# Altium schematic sheet 主控原理图（AD打开）.SchDoc
size A3
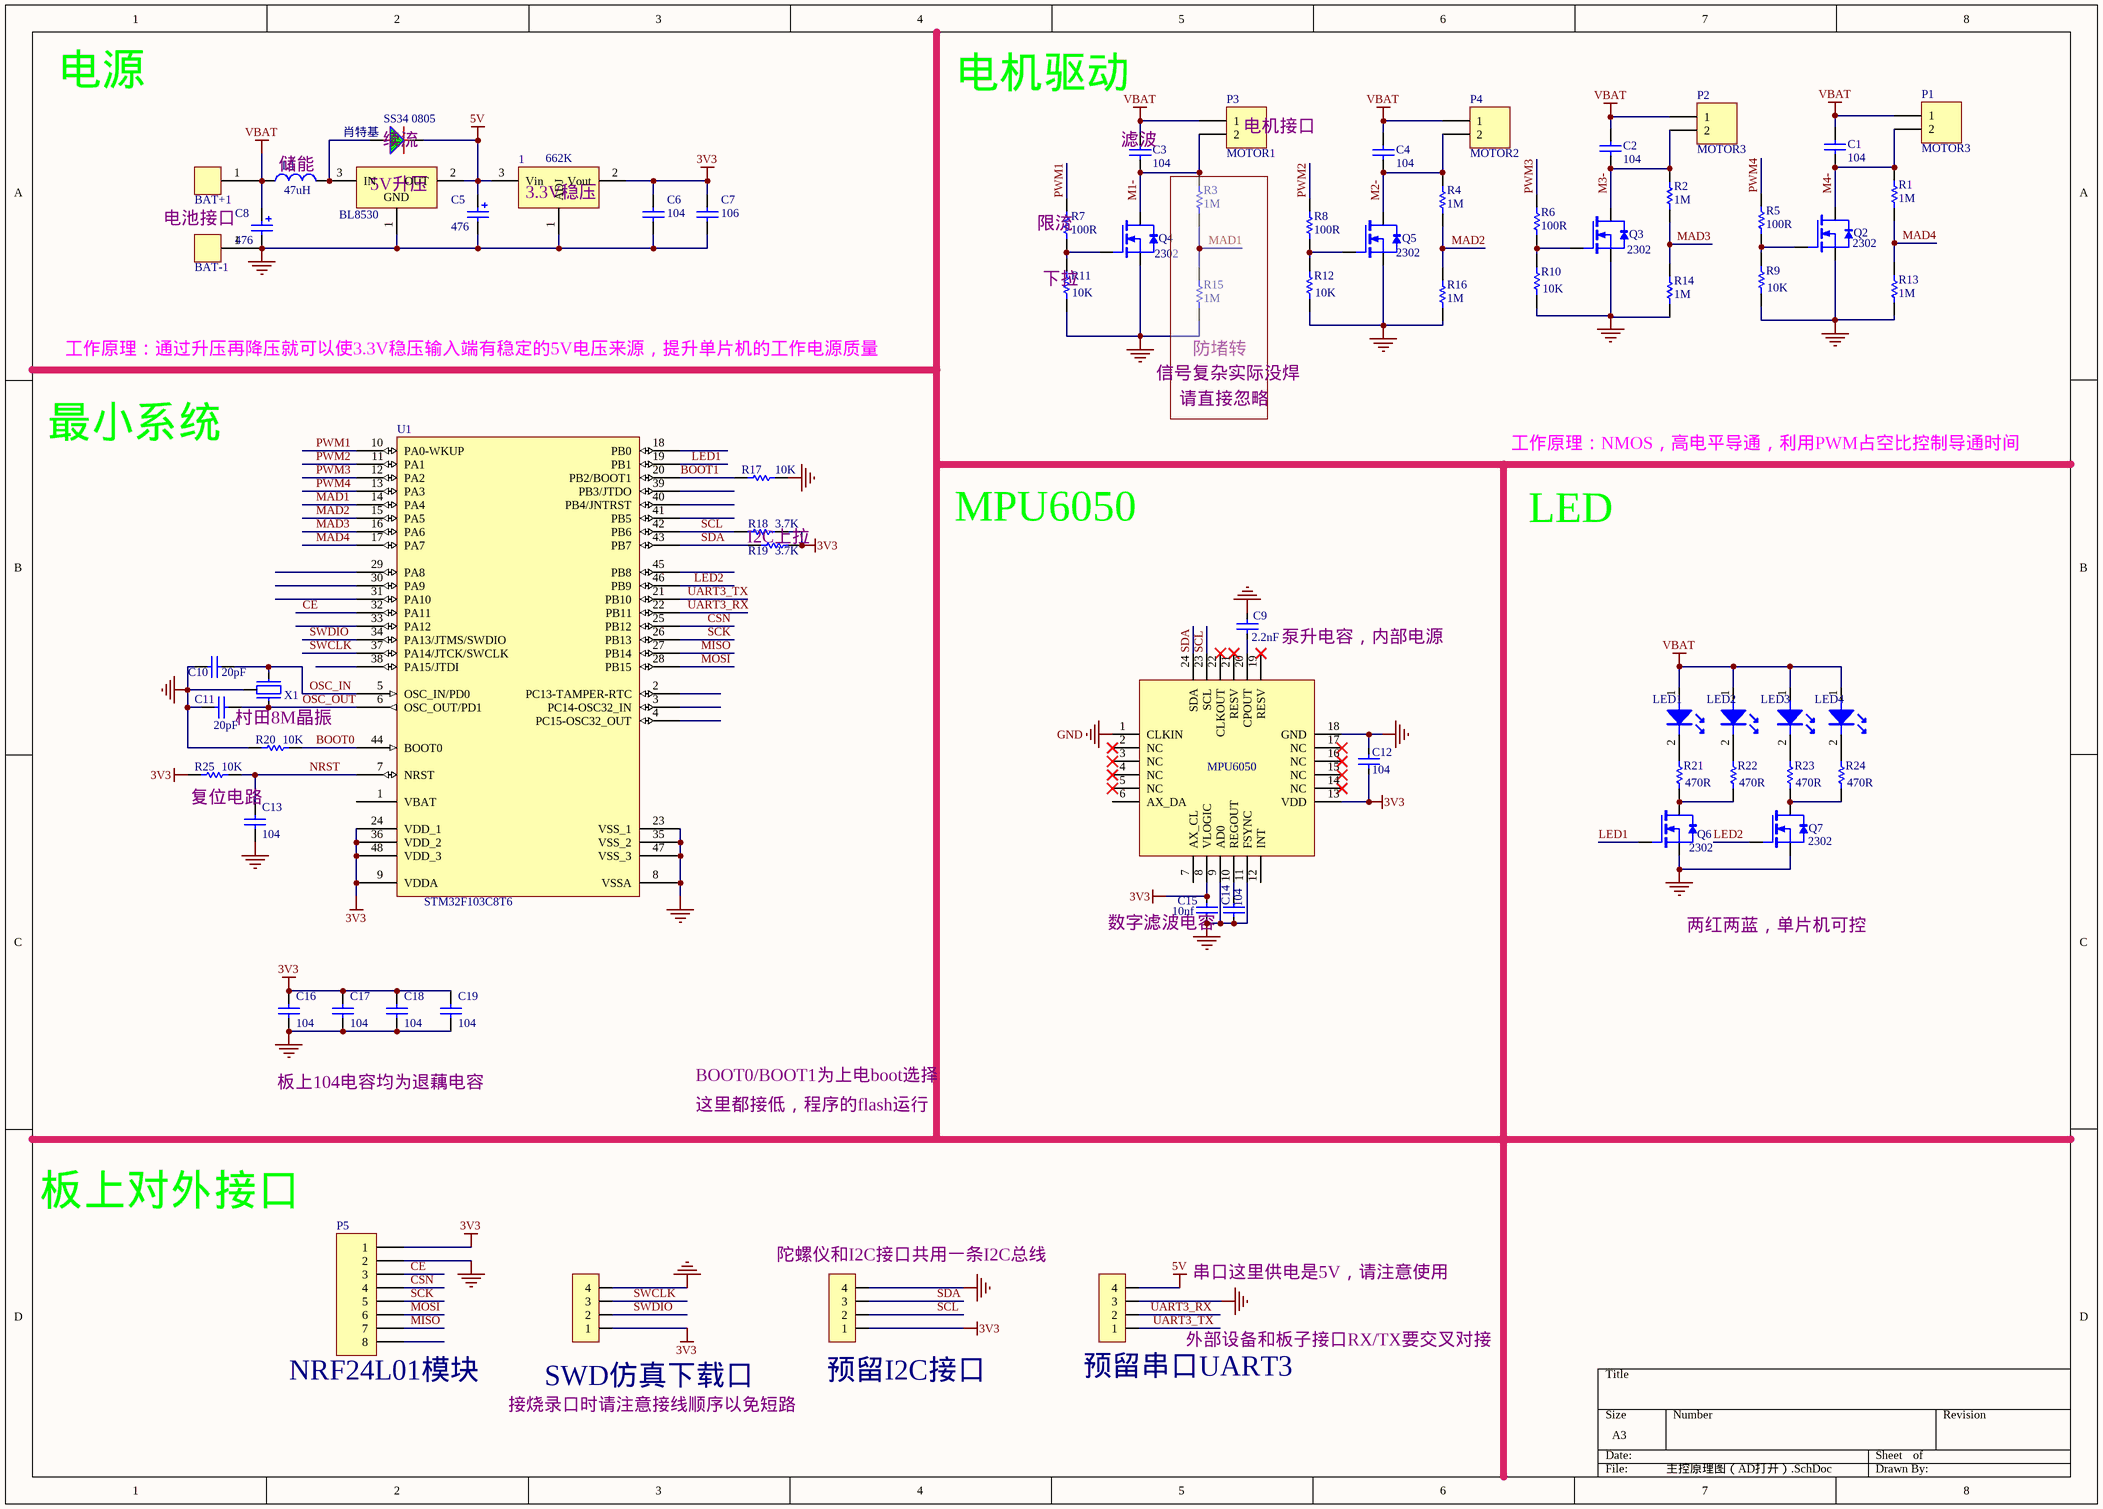
[diagram p0: 主控原理图（AD打开）.SchDoc]

## Parts
(Parts that share a designator on the sheet are numbered #1, #2 ... from top to bottom, then left to right.)
1  662K  [LDO]
BAT+1  Header 1  [电池接口]  (value not drawn)
BAT-1  Header 1  [电池接口]  (value not drawn)
BL8530  7750  [SOT-89]  (value not drawn)
C1  value 104  [0603_C]  (hidden comment: Cap Chip 1206)
C2  value 104  [0603_C]  (hidden comment: Cap Chip 1206)
C3  value 104  [0603_C]  (hidden comment: Cap Chip 1206)
C4  104  [0603_C]
C5  value 476  [1206]  (hidden comment: Cap Tan A)
C6  value 104  [0603_C]  (hidden comment: Cap Chip 1206)
C7  value 106  [0603_c]  (hidden comment: Cap Chip 1206)
C8  value 476  [1206]  (hidden comment: Cap Tan A)
C9  value 2.2nF  [0603_C]  (hidden comment: Cap_0603)
C10  20pF  [0603_C]
C11  20pF  [0603_C]
C12  value 104  [0603_C]  (hidden comment: Cap_0603)
C13  104  [0603_C]
C14  value 104  [0603_C]  (hidden comment: Cap_0603)
C15  value 10nf  [0603_C]  (hidden comment: Cap_0603)
C16  104  [0603_C]
C17  104  [0603_C]
C18  104  [0603_C]
C19  104  [0603_C]
L1  value 47uH  [电感]  (hidden comment: Inductor Chip)
LED1  LED  [0603_D]  (value not drawn)
LED2  LED  [0603_D]  (value not drawn)
LED3  LED  [0603_D]  (value not drawn)
LED4  LED  [0603_D]  (value not drawn)
P1  MOTOR3  [MOTOR]
P2  MOTOR3  [MOTOR]
P3  MOTOR1  [MOTOR]
P4  MOTOR2  [MOTOR]
P5  NRF24L01模块  [NRF]
Q1  NMOS(1)_1  [TO-220AB]  (value not drawn)
Q2#1  NMOS(1)_1  [TO-220AB]  (value not drawn)
Q2#2  2302  [NMOS]
Q3  2302  [NMOS]
Q4  2302  [NMOS]
Q5  2302  [NMOS]
Q6  2302  [NMOS]
Q7  2302  [NMOS]
R1  value 1M  [0603_R]  (hidden comment: Res1)
R2  value 1M  [0603_R]  (hidden comment: Res1)
R3  value 1M  [0603_R]  (hidden comment: Res1)
R4  value 1M  [0603_R]  (hidden comment: Res1)
R5  value 100R  [0603_R]  (hidden comment: Res1)
R6  value 100R  [0603_R]  (hidden comment: Res1)
R7  value 100R  [0603_R]  (hidden comment: Res1)
R8  value 100R  [0603_R]  (hidden comment: Res1)
R9  value 10K  [0603_R]  (hidden comment: Res1)
R10  value 10K  [0603_R]  (hidden comment: Res1)
R11  value 10K  [0603_R]  (hidden comment: Res1)
R12  value 10K  [0603_R]  (hidden comment: Res1)
R13  value 1M  [0603_R]  (hidden comment: Res1)
R14  value 1M  [0603_R]  (hidden comment: Res1)
R15  value 1M  [0603_R]  (hidden comment: Res1)
R16  value 1M  [0603_R]  (hidden comment: Res1)
R17  value 10K  [0603_R]  (hidden comment: Res1)
R18  value 3.7K  [0603_R]  (hidden comment: Res1)
R19  value 3.7K  [0603_R]  (hidden comment: Res1)
R20  value 10K  [0603_R]  (hidden comment: Res1)
R21  value 470R  [0603_R]  (hidden comment: Res1)
R22  value 470R  [0603_R]  (hidden comment: Res1)
R23  value 470R  [0603_R]  (hidden comment: Res1)
R24  value 470R  [0603_R]  (hidden comment: Res1)
R25  value 10K  [0603_R]  (hidden comment: Res1)
SS34_0805  肖特基  [0805]
SWD仿真下载口  SWD  [1.27*4]  (value not drawn)
U1  STM32F103C8T6  [LQFP48]
U2  MPU6050  [QFN24]
UART1  预留串口UART3  [1.27*4]
X1  XTAL_SMT  [OSC]  (value not drawn)
预留I2C接口  SWD  [1.27*4]  (value not drawn)

## Nets
3V3: 1.2(Vout) C6.1 C7.1 C12.1 C15.2 C16.1 C17.1 C18.1 C19.1 P5.1 R18.1 R19.1 R25.2 SWD仿真下载口.1 U1.9(VDDA) U1.24(VDD_1) U1.36(VDD_2) U1.48(VDD_3) U2.8(VLOGIC) U2.13(VDD) 预留I2C接口.1
5V: 1.3(Vin) BL8530.2(OUT) C5.2 SS34_0805.2 UART1.4
GND: 1.1(ADJ) BAT-1.1 BL8530.1(GND) C5.1 C6.2 C7.2 C8.1 C9.2 C10.2 C11.2 C12.2 C13.2 C14.1 C15.1 C16.2 C17.2 C18.2 C19.2 P5.2 Q2#2.3(S) Q3.3(S) Q4.3(S) Q5.3(S) Q6.3(S) Q7.3(S) R9.1 R10.1 R11.1 R12.1 R13.2 R14.2 R15.2 R16.2 R17.1 R20.2 SWD仿真下载口.4 U1.8(VSSA) U1.23(VSS_1) U1.35(VSS_2) U1.47(VSS_3) U2.1(CLKIN) U2.9(AD0) U2.11(FSYNC) U2.18(GND) UART1.3 X1.0 预留I2C接口.4
VBAT: BAT+1.1 C1.2 C2.2 C3.2 C4.2 C8.2 L1.1 LED1.1 LED2.1 LED3.1 LED4.1 P1.1 P2.1 P3.1 P4.1
BOOT0: R20.1 U1.44(BOOT0)
BOOT1: R17.2 U1.20(PB2/BOOT1)
CE: P5.3 U1.32(PA11)
CSN: P5.4 U1.25(PB12)
LED1: Q6.1(G) U1.19(PB1)
LED2: Q7.1(G) U1.46(PB9)
M1-: C3.1 P3.2 Q4.2(D) R3.1
M2-: C4.1 P4.2 Q5.2(D) R4.1
M3-: C2.1 P2.2 Q3.2(D) R2.1
M4-: C1.1 P1.2 Q2#2.2(D) R1.1
MAD1: R3.2 R15.1 U1.14(PA4)
MAD2: R4.2 R16.1 U1.15(PA5)
MAD3: R2.2 R14.1 U1.16(PA6)
MAD4: R1.2 R13.1 U1.17(PA7)
MISO: P5.7 U1.27(PB14)
MOSI: P5.6 U1.28(PB15)
NRST: C13.1 R25.1 U1.7(NRST)
OSC_IN: C10.1 U1.5(OSC_IN/PD0) X1.2
OSC_OUT: C11.1 U1.6(OSC_OUT/PD1) X1.1
PWM1: R7.1 U1.10(PA0-WKUP)
PWM2: R8.1 U1.11(PA1)
PWM3: R6.1 U1.12(PA2)
PWM4: R5.1 U1.13(PA3)
SCK: P5.5 U1.26(PB13)
SCL: R18.2 U1.42(PB6) U2.23(SCL) 预留I2C接口.2
SDA: R19.2 U1.43(PB7) U2.24(SDA) 预留I2C接口.3
SWCLK: SWD仿真下载口.3 U1.37(PA14/JTCK/SWCLK)
SWDIO: SWD仿真下载口.2 U1.34(PA13/JTMS/SWDIO)
UART3_RX: U1.22(PB11) UART1.2
UART3_TX: U1.21(PB10) UART1.1
NetBL8530_3: BL8530.3(IN) L1.2 SS34_0805.1
NetC9_1: C9.1 U2.20(CPOUT)
NetC14_2: C14.2 U2.10(REGOUT)
NetLED1_2: LED1.2 R21.2
NetLED2_2: LED2.2 R22.2
NetLED3_2: LED3.2 R23.2
NetLED4_2: LED4.2 R24.2
NetQ2#2_1: Q2#2.1(G) R5.2 R9.2
NetQ3_1: Q3.1(G) R6.2 R10.2
NetQ4_1: Q4.1(G) R7.2 R11.2
NetQ5_1: Q5.1(G) R8.2 R12.2
NetQ6_2: Q6.2(D) R21.1 R22.1
NetQ7_2: Q7.2(D) R23.1 R24.1

Not connected (* = marked no-connect by the designer): P5 8; U1 1(VBAT) 2(PC13-TAMPER-RTC) 3(PC14-OSC32_IN) 4(PC15-OSC32_OUT) 18(PB0) 29(PA8) 30(PA9) 31(PA10) 33(PA12) 38(PA15/JTDI) 39(PB3/JTDO) 40(PB4/JNTRST) 41(PB5) 45(PB8); U2 2(NC)* 3(NC)* 4(NC)* 5(NC)* 6(AX_DA) 7(AX_CL) 12(INT) 14(NC)* 15(NC)* 16(NC)* 17(NC)* 19(RESV)* 21(RESV)* 22(CLKOUT)*

## Notes on the sheet
- 电源
- 电机驱动
- (near L1) 储能
- (near SS34_0805) 续流
- (near C3) 滤波
- (near P3) 电机接口
- 电池接口
- (near BL8530) 5V升压
- (near 1) 3.3V稳压
- (near R7) 限流
- (near R11) 下拉
- 工作原理：通过升压再降压就可以使3.3V稳压输入端有稳定的5V电压来源，提升单片机的工作电源质量
- 信号复杂实际没焊
- (near R15) 防堵转
- 最小系统
- 请直接忽略
- 工作原理：NMOS，高电平导通，利用PWM占空比控制导通时间
- I2C上拉
- MPU6050
- LED
- 泵升电容，内部电源
- 村田8M晶振
- (near R25) 复位电路
- 数字滤波电容
- 两红两蓝，单片机可控
- 板上104电容均为退藕电容
- BOOT0/BOOT1为上电boot选择
- 这里都接低，程序的flash运行
- 板上对外接口
- (near 预留I2C接口) 陀螺仪和I2C接口共用一条I2C总线
- 串口这里供电是5V，请注意使用
- 外部设备和板子接口RX/TX要交叉对接
- 接烧录口时请注意接线顺序以免短路

## Library data of the parts
1 = LM317: 3-Terminal Adjustable Positive Voltage Regulator
BL8530 = HT7750: POSITIVE OUTPUT VOLTAGE
C1-C4 C6 C7 = Cap Chip 1206: Polarized Capacitor (Radial); Published: 8-Jun-2000; Revision: July-2002: Re-released for DXP Platform.; Publisher: Altium Limited
  C4: Value: 104
C5 C8 = Cap Tan A: Polarized Capacitor (Radial); Voltage: 16V; Published: 8-Jun-2000; Revision: July-2002: Re-released for DXP Platform.; Publisher: Altium Limited
C9 C12 C14 C15 = Cap_0603: Capacitor
C10 C11 C13 C16-C19 = C0603
L1 = Inductor Chip: Inductor; Published: 8-Jun-2000; Revision: July-2002: Re-released for DXP Platform.; Publisher: Altium Limited
P1-P4 = Header 2: Header, 2-Pin; LatestRevisionDate: 17-Jul-2002; LatestRevisionNote: Re-released for DXP Platform.; Publisher: Altium Limited
P5 = Header 8: Header, 8-Pin; LatestRevisionDate: 17-Jul-2002; LatestRevisionNote: Re-released for DXP Platform.; Publisher: Altium Limited
Q1 Q2#1 = NMOS(1)_1: N-Channel Power MOSFET; Note: Pin 2 is electrically connected to pin 4.; Published: 8-Jun-2000; LatestRevisionDate: 17-Jul-2002; LatestRevisionNote: Re-released for DXP Platform.; DatasheetVersion: PD-9.814; PackageVersion: Feb-1997; PackageReference: TO-220AB; Publisher: Altium Limited; PackageDescription: TO, Thru-Hole, Vertical, Heatsink Mounted; 3 In-Line Leads; Pitch 2.54 mm; ComponentLink1Description: Manufacturer Link; ComponentLink1URL: http://www.irf.com/
Q2#2 Q3 Q5-Q7 = N_MOS: N-Channel Power MOSFET
Q4 = N_MOS: N-Channel MOSFET
R1-R25 = Res1: Resistor; Published: 8-Jun-2000; LatestRevisionDate: 17-Jul-2002; LatestRevisionNote: Re-released for DXP Platform.; PackageReference: 0603_R; Publisher: Altium Limited; PackageDescription: Axial Device, Thru-Hole; 2 Leads; 0.3 in Pin Spacing
SS34_0805 = DIODE
SWD仿真下载口 UART1 预留I2C接口 = Header 4H: Header, 4-Pin, Right Angle; LatestRevisionDate: 17-Jul-2002; LatestRevisionNote: Re-released for DXP Platform.; Publisher: Altium Limited